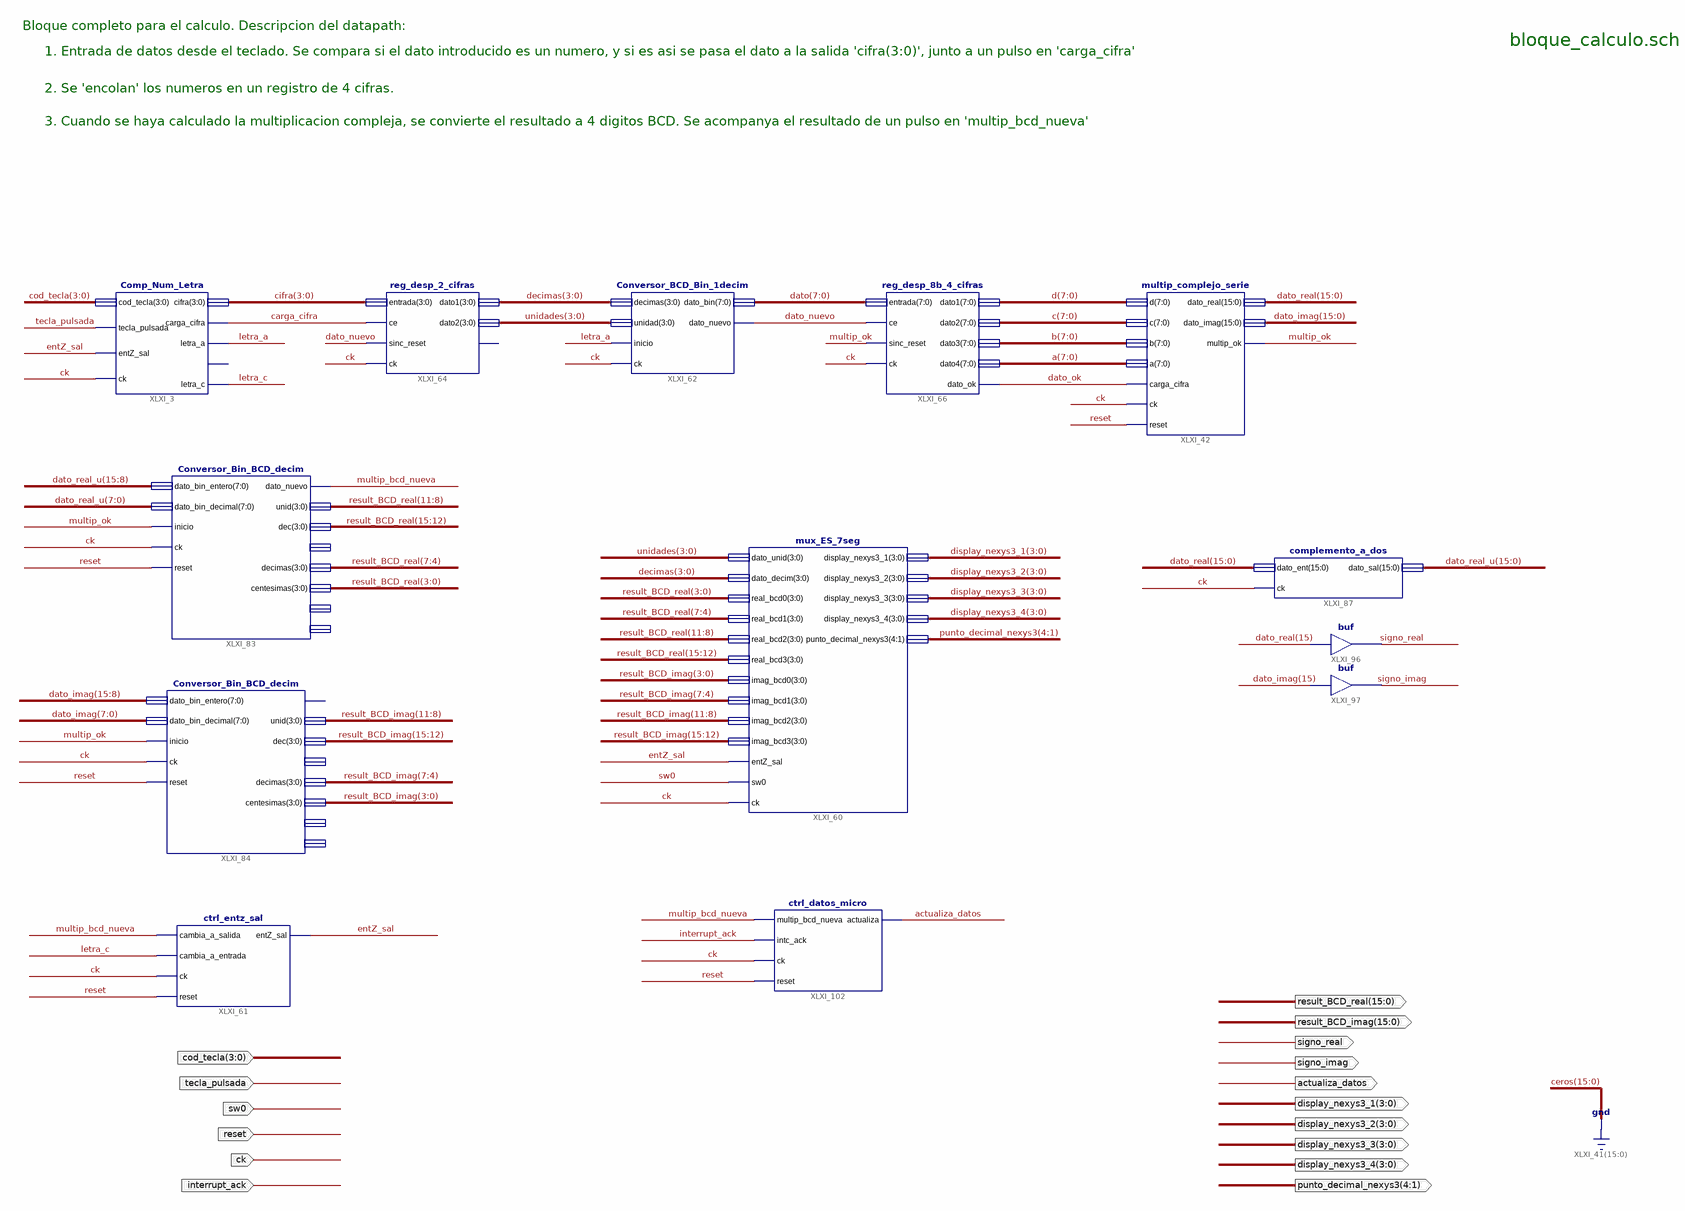
[diagram p0: schematic sheet 1]
// Xilinx ISE schematic bloque_calculo.sch (spartan6) as structural Verilog: 13 symbols, 17 ports
module bloque_calculo (
  input  ck,
  input  [3:0] cod_tecla,
  input  tecla_pulsada,
  input  reset,
  input  sw0,
  input  interrupt_ack,
  output [4:1] punto_decimal_nexys3,
  output [3:0] display_nexys3_4,
  output [3:0] display_nexys3_3,
  output [3:0] display_nexys3_2,
  output [3:0] display_nexys3_1,
  output multip_bcd_nueva,
  output signo_real,
  output signo_imag,
  output actualiza_datos,
  output [15:0] result_BCD_imag,
  output [15:0] result_BCD_real
);

  wire carga_cifra, dato_nuevo, dato_ok, entZ_sal, letra_a, letra_c, multip_ok;
  wire [3:0] cifra, decimas, unidades;
  wire [7:0] a, b, c, d, dato;
  wire [15:0] dato_imag, dato_real, dato_real_u;

  Comp_Num_Letra XLXI_3 (
    .tecla_pulsada(tecla_pulsada), .ck(ck), .cod_tecla(cod_tecla), .entZ_sal(entZ_sal),
    .carga_cifra(carga_cifra), .letra_a(letra_a), .cifra(cifra), .letra_c(letra_c));  // open: letra_b
  ctrl_entz_sal XLXI_61 (
    .ck(ck), .reset(reset), .cambia_a_salida(multip_bcd_nueva), .cambia_a_entrada(letra_c),
    .entZ_sal(entZ_sal));
  multip_complejo_serie XLXI_42 (
    .a(a), .b(b), .c(c), .carga_cifra(dato_ok), .ck(ck), .d(d), .reset(reset), .dato_imag(dato_imag),
    .dato_real(dato_real), .multip_ok(multip_ok));
  reg_desp_2_cifras XLXI_64 (
    .ce(carga_cifra), .ck(ck), .dato1(decimas), .dato2(unidades), .entrada(cifra), .sinc_reset(dato_nuevo));  // open: dato_ok
  reg_desp_8b_4_cifras XLXI_66 (
    .ce(dato_nuevo), .ck(ck), .dato1(d), .dato2(c), .dato3(b), .dato4(a), .dato_ok(dato_ok), .entrada(dato),
    .sinc_reset(multip_ok));
  Conversor_BCD_Bin_1decim XLXI_62 (
    .unidad(unidades), .decimas(decimas), .inicio(letra_a), .ck(ck), .dato_nuevo(dato_nuevo), .dato_bin(dato));
  Conversor_Bin_BCD_decim XLXI_83 (
    .dato_nuevo(multip_bcd_nueva), .unid(result_BCD_real[11:8]), .dec(result_BCD_real[15:12]),
    .decimas(result_BCD_real[7:4]), .centesimas(result_BCD_real[3:0]), .dato_bin_entero(dato_real_u[15:8]),
    .dato_bin_decimal(dato_real_u[7:0]), .inicio(multip_ok), .ck(ck), .reset(reset));  // open: cent, milesimas, diezmilesimas
  Conversor_Bin_BCD_decim XLXI_84 (
    .unid(result_BCD_imag[11:8]), .dec(result_BCD_imag[15:12]), .decimas(result_BCD_imag[7:4]),
    .centesimas(result_BCD_imag[3:0]), .dato_bin_entero(dato_imag[15:8]), .dato_bin_decimal(dato_imag[7:0]),
    .inicio(multip_ok), .ck(ck), .reset(reset));  // open: dato_nuevo, cent, milesimas, diezmilesimas
  mux_ES_7seg XLXI_60 (
    .ck(ck), .dato_decim(decimas), .dato_unid(unidades), .display_nexys3_1(display_nexys3_1),
    .display_nexys3_2(display_nexys3_2), .display_nexys3_3(display_nexys3_3),
    .display_nexys3_4(display_nexys3_4), .entZ_sal(entZ_sal), .imag_bcd0(result_BCD_imag[3:0]),
    .imag_bcd1(result_BCD_imag[7:4]), .imag_bcd2(result_BCD_imag[11:8]), .imag_bcd3(result_BCD_imag[15:12]),
    .punto_decimal_nexys3(punto_decimal_nexys3), .real_bcd0(result_BCD_real[3:0]),
    .real_bcd1(result_BCD_real[7:4]), .real_bcd2(result_BCD_real[11:8]), .real_bcd3(result_BCD_real[15:12]),
    .sw0(sw0));
  complemento_a_dos XLXI_87 (.ck(ck), .dato_ent(dato_real), .dato_sal(dato_real_u));
  buf XLXI_96 (signo_real, dato_real[15]);
  buf XLXI_97 (signo_imag, dato_imag[15]);
  ctrl_datos_micro XLXI_102 (
    .multip_bcd_nueva(multip_bcd_nueva), .actualiza(actualiza_datos), .intc_ack(interrupt_ack),
    .reset(reset), .ck(ck));

  // Notes on the sheet:
  //   Bloque completo para el calculo. Descripcion del datapath:
  //   bloque_calculo.sch
  //   1. Entrada de datos desde el teclado. Se compara si el dato introducido es un numero, y si es asi se pasa el dato a la salida 'cifra(3:0)', junto a un pulso en 'carga_cifra'
  //   2. Se 'encolan' los numeros en un registro de 4 cifras.
  //   3. Cuando se haya calculado la multiplicacion compleja, se convierte el resultado a 4 digitos BCD. Se acompanya el resultado de un pulso en 'multip_bcd_nueva'
endmodule
